# Altium project STM32P48.PrjPcb
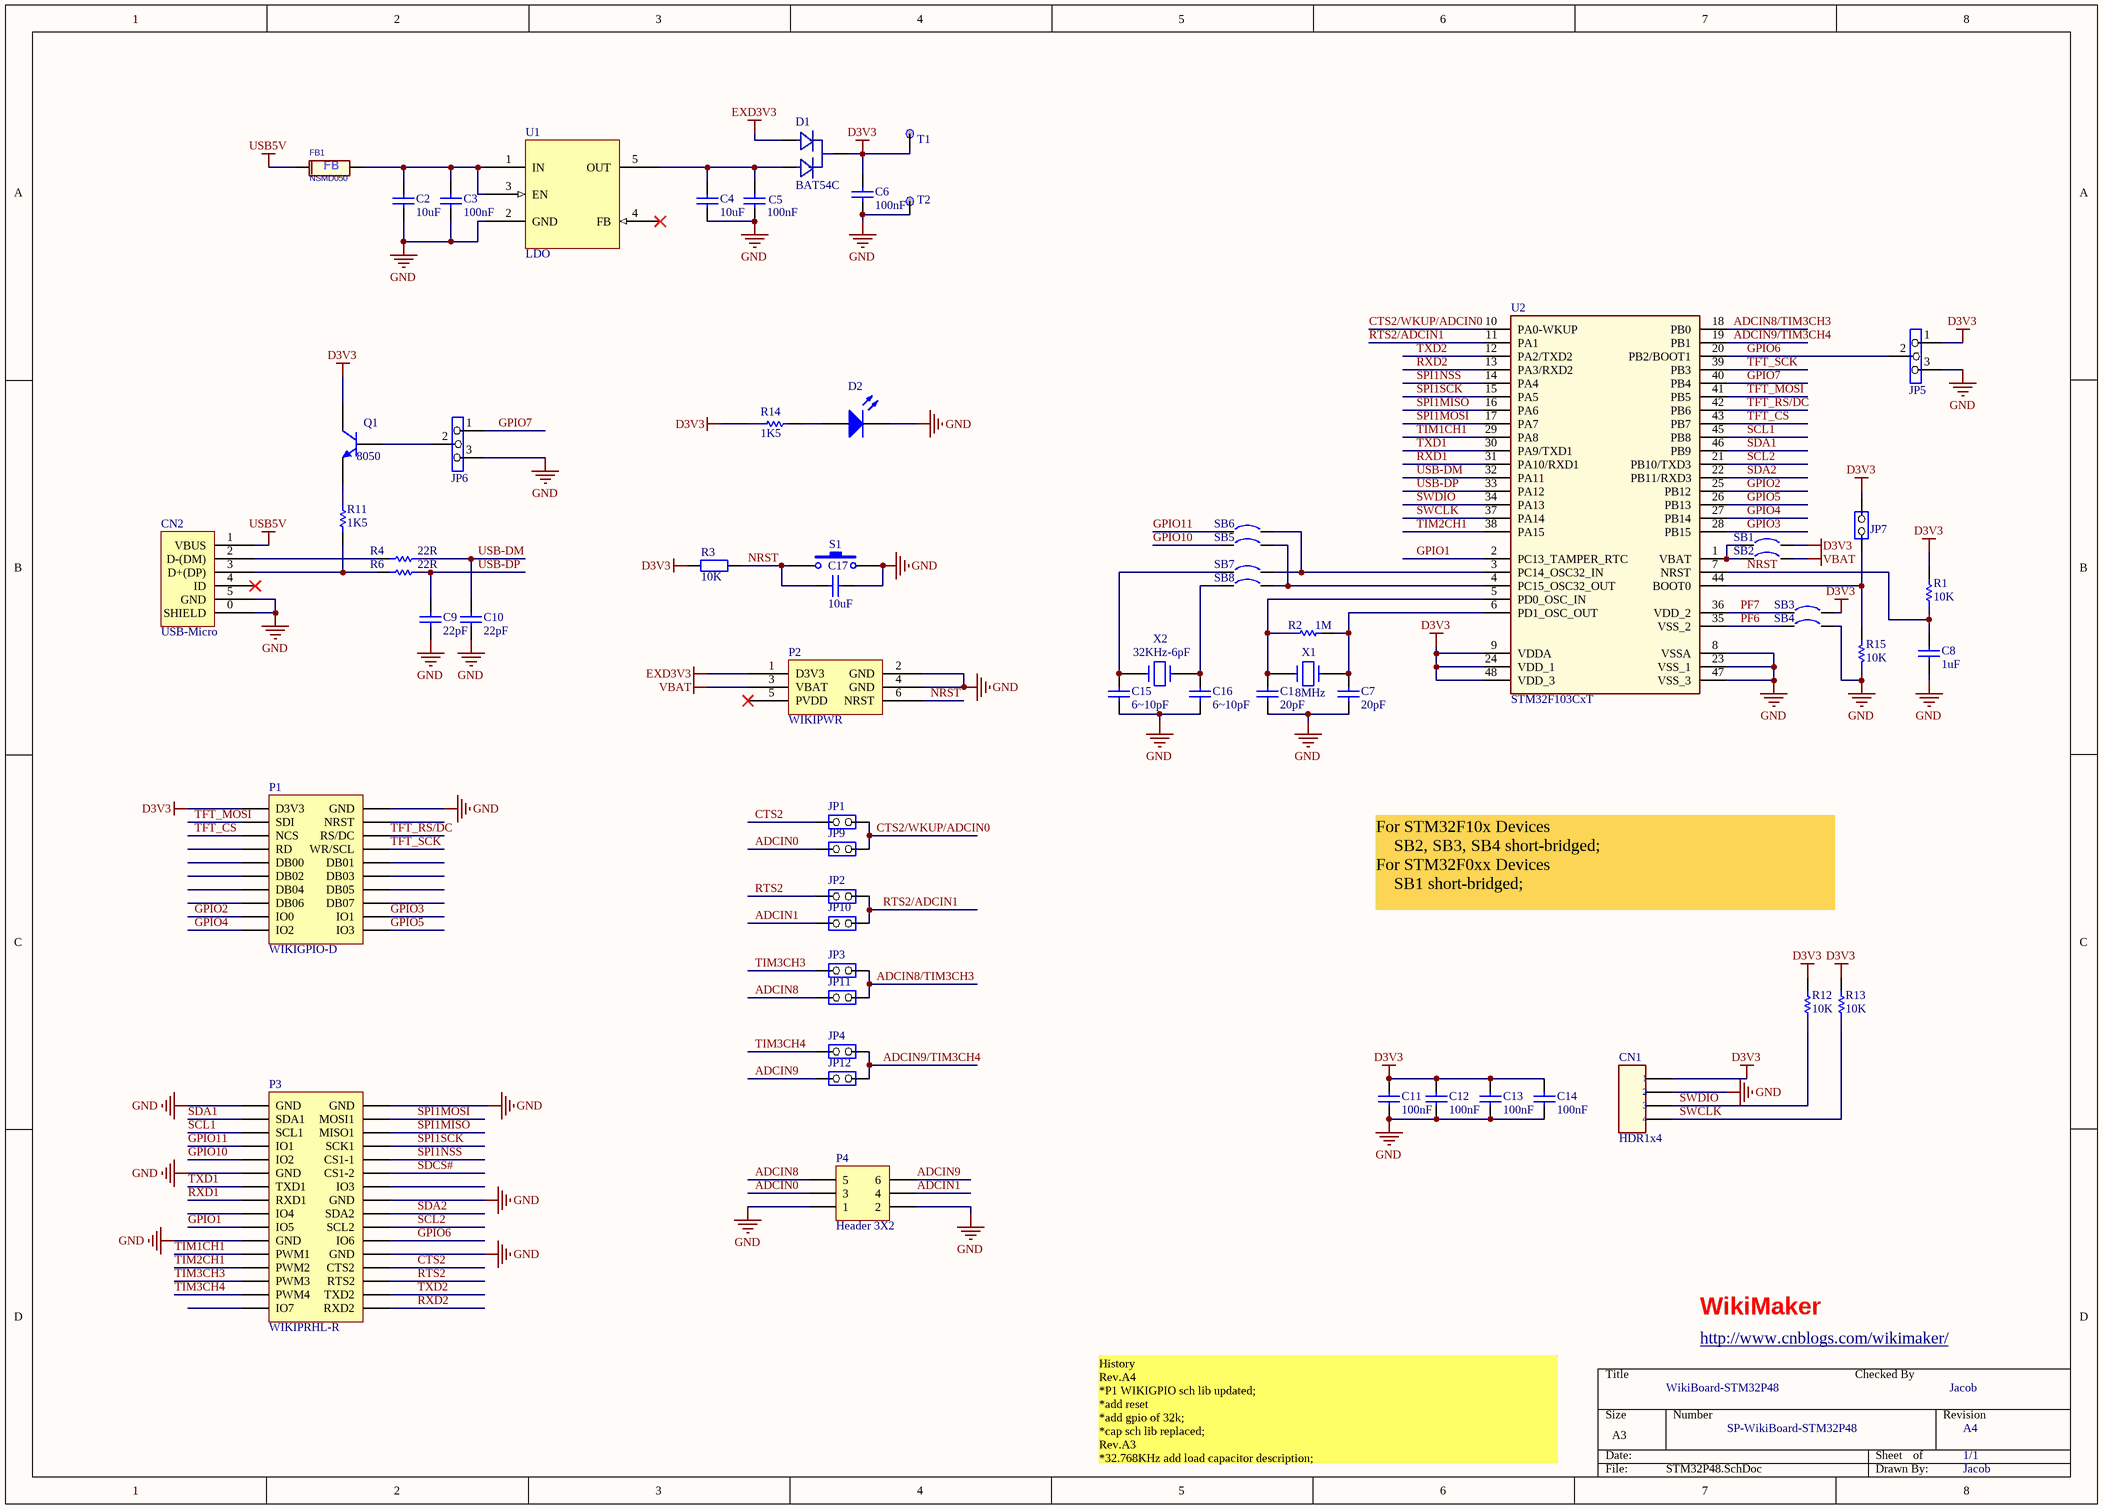
[diagram p0: STM32P48.SchDoc]
1 sheet, 63 parts. Net scope: global (net labels, ports and power ports of the same name join across sheets).
Board file: STM32P48.PcbDoc

## Sheet STM32P48.SchDoc
size A3; Author: 符观辉; DrawnBy: 符观辉

### Parts
C1  20pF  [C0603L]
C2  10uF  [C0805]
C3  100nF  [C0603L]
C4  10uF  [C0805]
C5  100nF  [C0603L]
C6  100nF  [C0603L]
C7  20pF  [C0603L]
C8  1uF  [C0603L]
C9  22pF  [C0603L]
C10  22pF  [C0603L]
C11  100nF  [C0603L]
C12  100nF  [C0603L]
C13  100nF  [C0603L]
C14  100nF  [C0603L]
C15  6~10pF  [C0603L]
C16  6~10pF  [C0603L]
C17  10uF  [C0603L]
CN1  HDR1x4  [HDR1x4]
CN2  USB-Micro  [USB-MICRO-Lite]
D1  BAT54C  [BAT54C]
D2  LED1  [0603PN]  (value not drawn)
FB1  NSMD050  [R1206]
JP1  Jumper2-2  [HDR1X2/2.00MM]  (value not drawn)
JP2  Jumper2-2  [HDR1X2/2.00MM]  (value not drawn)
JP3  Jumper2-2  [HDR1X2/2.00MM]  (value not drawn)
JP4  Jumper2-2  [HDR1X2/2.00MM]  (value not drawn)
JP5  Jumper3  [HDR1X3/2.00mm]  (value not drawn)
JP6  Jumper3  [HDR1X3/2.00mm]  (value not drawn)
JP7  Jumper2-2  [HDR1X2/2.00MM]  (value not drawn)
JP9  Jumper2-2  [HDR1X2/2.00MM]  (value not drawn)
JP10  Jumper2-2  [HDR1X2/2.00MM]  (value not drawn)
JP11  Jumper2-2  [HDR1X2/2.00MM]  (value not drawn)
JP12  Jumper2-2  [HDR1X2/2.00MM]  (value not drawn)
P1  WIKIGPIO-D  [WIKIGPIO-U]
P2  WIKIPWR  [WIKIPWR]
P3  WIKIPRHL-R  [HDR2X16-WIKIPRHL-R]
P4  Header 3X2  [HDR2X3/2.54MM]
Q1  8050  [SOT23-3L(123)]
R1  10K  [R0603]
R2  1M  [R0603]
R3  10K  [R0603]
R4  22R  [R0603]
R6  22R  [R0603]
R11  1K5  [R0603]
R12  10K  [R0603]
R13  10K  [R0603]
R14  1K5  [R0603]
R15  10K  [R0603]
S1  (no value)  [KEY-2x4-SMD]
SB1  Circuit Breaker  [JP2_SMD]  (value not drawn)
SB2  Circuit Breaker  [JP2_SMD]  (value not drawn)
SB3  Circuit Breaker  [JP2_SMD]  (value not drawn)
SB4  Circuit Breaker  [JP2_SMD]  (value not drawn)
SB5  Circuit Breaker  [JP2_SMD]  (value not drawn)
SB6  Circuit Breaker  [JP2_SMD]  (value not drawn)
SB7  Circuit Breaker  [JP2_SMD]  (value not drawn)
SB8  Circuit Breaker  [JP2_SMD]  (value not drawn)
T1  TP  [TP]  (value not drawn)
T2  TP  [TP]  (value not drawn)
U1  LDO  [SOT23-5]
U2  STM32F103CxT  [LQFP-48]
X1  8MHz  [XTAL_socket]
X2  32KHz-6pF  [XTAL0602]

### Nets
D3V3: C6.1 C11.1 C12.1 C13.1 C14.1 CN1.1 D1.3 JP5.1 JP7.2(NO) P1.1(D3V3) Q1.3(C) R1.2 R3.1 R12.2 R13.2 R14.1 SB1.2 SB3.2 T1.1 U2.9(VDDA) U2.24(VDD_1) U2.48(VDD_3)
EXD3V3: D1.2 P2.1(D3V3)
GND: C1.2 C2.2 C3.2 C4.2 C5.2 C6.2 C7.2 C8.2 C9.2 C10.2 C11.2 C12.2 C13.2 C14.2 C15.2 C16.2 C17.1 CN1.2 CN2.0(SHIELD) CN2.5(GND) D2.2(K) JP5.3 JP6.3 P1.2(GND) P2.2(GND) P2.4(GND) P3.1(GND) P3.2(GND) P3.11(GND) P3.16(GND) P3.21(GND) P3.24(GND) P4.1 P4.2 R15.1 S1.1 SB4.2 T2.1 U1.2(GND) U2.8(VSSA) U2.23(VSS_1) U2.47(VSS_3)
USB5V: CN2.1(VBUS) FB1.1
VBAT: P2.3(VBAT) SB2.2
ADCIN0: JP9.1(COMMON) P4.3
ADCIN1: JP10.1(COMMON) P4.4
ADCIN8: JP11.1(COMMON) P4.5
ADCIN8/TIM3CH3: JP3.2(NO) JP11.2(NO) U2.18(PB0)
ADCIN9: JP12.1(COMMON) P4.6
ADCIN9/TIM3CH4: JP4.2(NO) JP12.2(NO) U2.19(PB1)
CTS2: JP1.1(COMMON) P3.26(CTS2)
CTS2/WKUP/ADCIN0: JP1.2(NO) JP9.2(NO) U2.10(PA0-WKUP)
GPIO1: P3.19(IO5) U2.2(PC13_TAMPER_RTC)
GPIO2: P1.17(IO0) U2.25(PB12)
GPIO3: P1.18(IO1) U2.28(PB15)
GPIO4: P1.19(IO2) U2.27(PB14)
GPIO5: P1.20(IO3) U2.26(PB13)
GPIO6: JP5.2 P3.22(IO6) U2.20(PB2/BOOT1)
GPIO7: JP6.1 U2.40(PB4)
GPIO10: P3.9(IO2) SB5.1
GPIO11: P3.7(IO1) SB6.1
NRST: C8.1 C17.2 P2.6(NRST) R1.1 R3.2 S1.2 U2.7(NRST)
PF6: SB4.1 U2.35(VSS_2)
PF7: SB3.1 U2.36(VDD_2)
RTS2: JP2.1(COMMON) P3.28(RTS2)
RTS2/ADCIN1: JP2.2(NO) JP10.2(NO) U2.11(PA1)
RXD1: P3.15(RXD1) U2.31(PA10/RXD1)
RXD2: P3.32(RXD2) U2.13(PA3/RXD2)
SCL1: P3.5(SCL1) U2.45(PB8)
SCL2: P3.20(SCL2) U2.21(PB10/TXD3)
SDA1: P3.3(SDA1) U2.46(PB9)
SDA2: P3.18(SDA2) U2.22(PB11/RXD3)
SDCS#: P3.12(CS1-2)
SPI1MISO: P3.6(MISO1) U2.16(PA6)
SPI1MOSI: P3.4(MOSI1) U2.17(PA7)
SPI1NSS: P3.10(CS1-1) U2.14(PA4)
SPI1SCK: P3.8(SCK1) U2.15(PA5)
SWCLK: CN1.4 R13.1 U2.37(PA14)
SWDIO: CN1.3 R12.1 U2.34(PA13)
TFT_CS: P1.5(NCS) U2.43(PB7)
TFT_MOSI: P1.3(SDI) U2.41(PB5)
TFT_RS/DC: P1.6(RS/DC) U2.42(PB6)
TFT_SCK: P1.8(WR/SCL) U2.39(PB3)
TIM1CH1: P3.23(PWM1) U2.29(PA8)
TIM2CH1: P3.25(PWM2) U2.38(PA15)
TIM3CH3: JP3.1(COMMON) P3.27(PWM3)
TIM3CH4: JP4.1(COMMON) P3.29(PWM4)
TXD1: P3.13(TXD1) U2.30(PA9/TXD1)
TXD2: P3.30(TXD2) U2.12(PA2/TXD2)
USB-DM: C10.1 R4.1 U2.32(PA11)
USB-DP: C9.1 R6.1 U2.33(PA12)
NetC1_1: C1.1 R2.1 U2.5(PD0_OSC_IN) X1.2
NetC2_1: C2.1 C3.1 FB1.2 U1.1(IN) U1.3(EN)
NetC4_1: C4.1 C5.1 D1.1 U1.5(OUT)
NetC7_1: C7.1 R2.2 U2.6(PD1_OSC_OUT) X1.1
NetC15_1: C15.1 SB7.1 X2.2
NetC16_1: C16.1 SB8.1 X2.1
NetCN2_2: CN2.2(D-(DM)) R4.2
NetCN2_3: CN2.3(D+(DP)) R6.2 R11.2
NetD2_1: D2.1(A) R14.2
NetJP6_2: JP6.2 Q1.1(B)
NetJP7_1: JP7.1(COMMON) R15.2 U2.44(BOOT0)
NetQ1_2: Q1.2(E) R11.1
NetSB1_1: SB1.1 SB2.1 U2.1(VBAT)
NetSB5_2: SB5.2 SB8.2 U2.4(PC15_OSC32_OUT)
NetSB6_2: SB6.2 SB7.2 U2.3(PC14_OSC32_IN)

Not connected (* = marked no-connect by the designer): CN2 4(ID)*; P1 4(NRST) 7(RD) 9(DB00) 10(DB01) 11(DB02) 12(DB03) 13(DB04) 14(DB05) 15(DB06) 16(DB07); P2 5(PVDD)*; P3 14(IO3) 17(IO4) 31(IO7); U1 4(FB)*

### Notes on the sheet
- For STM32F10x Devices
  SB2, SB3, SB4 short-bridged;
  For STM32F0xx Devices
  SB1 short-bridged;
- WikiMaker
- WikiBoard-STM32P48
- http://www.cnblogs.com/wikimaker/
- Checked By
- Jacob
- History
  Rev.A4
  *P1 WIKIGPIO sch lib updated;
  *add reset
  *add gpio of 32k;
  *cap sch lib replaced;
  Rev.A3
  *32.768KHz add load capacitor description;
  *add rst;
  *add crystal ios;
  Rev.A1
  First Release;
- SP-WikiBoard-STM32P48
- A4
- 1/1

### Library data of the parts
C1-C17 = Cap: Capacitor; Published: 8-Jun-2000; LatestRevisionDate: 17-Jul-2002; LatestRevisionNote: Re-released for DXP Platform.; PackageReference: RAD-0.3; Publisher: Altium Limited
  C1 C7: Value: 20pF
  C2 C4 C17: Value: 10uF
  C3 C5 C6 C11-C14: Value: 100nF
  C8: Value: 1uF
  C9 C10: Value: 22pF
  C15 C16: Value: 6~10pF
CN1 = CON4
D1 = BAT54C: DOUBLE SHOTTKEY DIODES
D2 = LED1: Typical RED GaAs LED; Published: 8-Jun-2000; LatestRevisionDate: 08-Jul-2005; LatestRevisionNote: Mech Layer 1 removed.; PackageReference: LED-1; Publisher: Altium Limited
FB1 = FB: Ferrite Beads Inductors Impedance:120Ω±25% Rated Current:1500mA DC Resistance:0.095Ω; Manufacturer: muRata; Manufacturer Part Number: BLM15EG121SN1
JP1-JP4 JP7 JP9-JP12 = Jumper2-2: Jumper2
P1 = WIKIGPIO-D: Header, 9-Pin, Dual row; LatestRevisionDate: 17-Jul-2002; LatestRevisionNote: Re-released for DXP Platform.; Publisher: Altium Limited
P2 = WIKIPWR: PWR HDR
P3 = WIKIPRHL-R: Header, 16-Pin, Dual row; LatestRevisionDate: 17-Jul-2002; LatestRevisionNote: Re-released for DXP Platform.; Publisher: Altium Limited
P4 = Header 3X2: Header, 3-Pin, Dual row; LatestRevisionDate: 17-Jul-2002; LatestRevisionNote: Re-released for DXP Platform.; Publisher: Altium Limited
Q1 = 8050: NPN General Purpose Amplifier; Publisher: Altium Limited
R1 R2 R4 R6 R11-R15 = RES: Resistor; Design Item Id: RES-50R-1%-0805
R3 = Res2: Resistor; Published: 8-Jun-2000; LatestRevisionDate: 17-Jul-2002; LatestRevisionNote: Re-released for DXP Platform.; PackageReference: AXIAL-0.4; Publisher: Altium Limited; Value: 10K
S1 = SW-PB: Switch; Published: 24-Mar-1999; LatestRevisionDate: 17-Jul-2002; LatestRevisionNote: Re-released for DXP Platform.; PackageReference: SPST-2; Publisher: Altium Limited
SB1-SB8 = Circuit Breaker: Solder: YES; Published: 24-Mar-1999; Revision: July-2002: Re-released for DXP Platform.; Publisher: Altium Limited
T1 T2 = TP: Test Point
U1 = LDO-SOT23-5: General LDO SOT23-5
U2 = STM32F103CxT: Cortex M3, 48-pin LQFP
X1 X2 = CRYSTAL